# EAGLE design i2c-sensor-bridge (EAGLE 7.4.0)
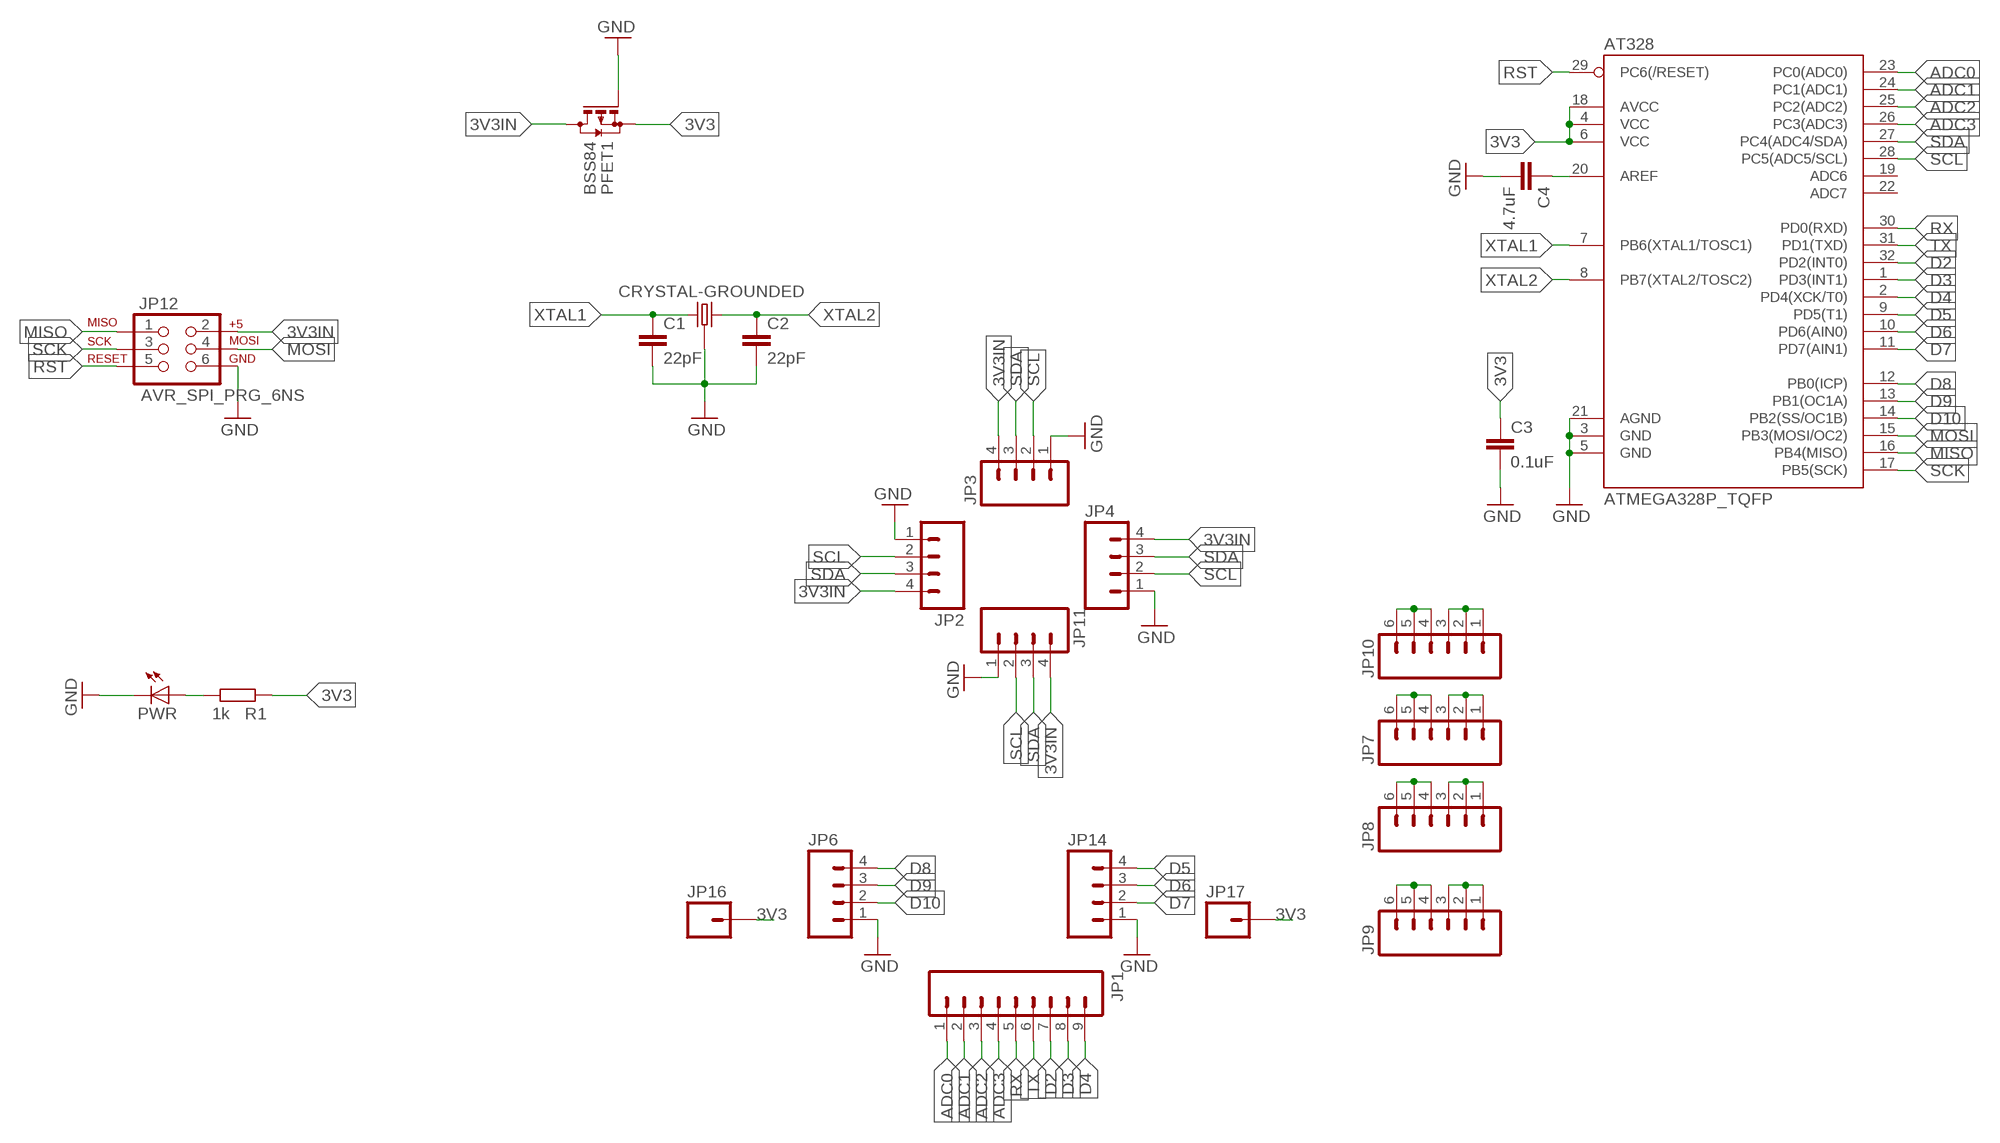
[diagram p0: schematic, sheet 1]

## Parts
AT328  ATMEGA328P_TQFP  [TQFP32-08]
C1  22pF  C-EUC0805  [C0805]
C2  22pF  C-EUC0805  [C0805]
C3  0.1uF  C-EUC0805  [C0805]
C4  4.7uF  C-EUC0805  [C0805]
CRYSTAL  CRYSTAL-GROUNDED  [CRYSTAL-SMD-5X3]
JP1  M09LOCK  [1X09_LOCK]
JP2  M04LOCK  [1X04_LOCK]
JP3  M04LOCK  [1X04_LOCK]
JP4  M04LOCK  [1X04_LOCK]
JP6  M04LOCK  [1X04_LOCK]
JP7  M06NO_SILK_FEMALE_PTH  [1X06_NO_SILK]
JP8  M06NO_SILK_FEMALE_PTH  [1X06_NO_SILK]
JP9  M06NO_SILK_FEMALE_PTH  [1X06_NO_SILK]
JP10  M06NO_SILK_FEMALE_PTH  [1X06_NO_SILK]
JP11  M04LOCK  [1X04_LOCK]
JP12  AVR_SPI_PRG_6NS  [2X3-NS]
JP14  M04LOCK  [1X04_LOCK]
JP16  M01PTH_NO_SILK_YES_STOP  [1X01_NO_SILK]
JP17  M01PTH_NO_SILK_YES_STOP  [1X01_NO_SILK]
PFET1  BSS84  [SOT23]
PWR  LEDCHIPLED_0805  [CHIPLED_0805]
R1  1k  R-EU_R0805  [R0805]

## Nets
3V3 [vreg]: AT328.4(VCC) AT328.6(VCC) AT328.18(AVCC) C3.1 JP16.1 JP17.1 PFET1.2(S) R1.2
3V3IN [vreg]: JP2.4 JP3.4 JP4.4 JP11.4 JP12.2 PFET1.3(D)
ADC0: AT328.23(PC0(ADC0)) JP1.1
ADC1: AT328.24(PC1(ADC1)) JP1.2
ADC2: AT328.25(PC2(ADC2)) JP1.3
ADC3: AT328.26(PC3(ADC3)) JP1.4
D2: AT328.32(PD2(INT0)) JP1.7
D3: AT328.1(PD3(INT1)) JP1.8
D4: AT328.2(PD4(XCK/T0)) JP1.9
D5: AT328.9(PD5(T1)) JP14.4
D6: AT328.10(PD6(AIN0)) JP14.3
D7: AT328.11(PD7(AIN1)) JP14.2
D8: AT328.12(PB0(ICP)) JP6.4
D9: AT328.13(PB1(OC1A)) JP6.3
D10: AT328.14(PB2(SS/OC1B)) JP6.2
GND: AT328.3(GND) AT328.5(GND) AT328.21(AGND) C1.2 C2.2 C3.2 C4.2 CRYSTAL.2 CRYSTAL.4 JP2.1 JP3.1 JP4.1 JP6.1 JP11.1 JP12.6 JP14.1 PFET1.1(G) PWR.C
MISO: AT328.16(PB4(MISO)) JP12.1
MOSI: AT328.15(PB3(MOSI/OC2)) JP12.4
N$1: PWR.A R1.1
N$2 [vreg]: JP10.4 JP10.5 JP10.6
N$3 [vreg]: JP10.1 JP10.2 JP10.3
N$4 [vreg]: JP7.1 JP7.2 JP7.3
N$5 [vreg]: JP7.4 JP7.5 JP7.6
N$6 [vreg]: JP8.4 JP8.5 JP8.6
N$7 [vreg]: JP8.1 JP8.2 JP8.3
N$8 [vreg]: JP9.1 JP9.2 JP9.3
N$9 [vreg]: JP9.4 JP9.5 JP9.6
N$10: AT328.20(AREF) C4.1
RST: AT328.29(PC6(/RESET)) JP12.5
RX: AT328.30(PD0(RXD)) JP1.5
SCK: AT328.17(PB5(SCK)) JP12.3
SCL: AT328.28(PC5(ADC5/SCL)) JP2.2 JP3.2 JP4.2 JP11.2
SDA: AT328.27(PC4(ADC4/SDA)) JP2.3 JP3.3 JP4.3 JP11.3
TX: AT328.31(PD1(TXD)) JP1.6
XTAL1: AT328.7(PB6(XTAL1/TOSC1)) C1.1 CRYSTAL.3
XTAL2: AT328.8(PB7(XTAL2/TOSC2)) C2.1 CRYSTAL.1
Unconnected: AT328.19(ADC6) AT328.22(ADC7)

## Library data of the parts
AT328 = SparkFun-DigitalIC:ATMEGA328P_TQFP; PROD_ID: IC-09069
C1-C4 = rcl:C-EU: CAPACITOR, European symbol
CRYSTAL = SparkFun-FreqCtrlED:CRYSTAL-GROUNDED
JP1 = SparkFun-Connectors:M09: Header 9 Standard 9-pin 0.1" header. Use with straight break away headers (SKU : PRT-00116), right angle break away headers (PRT-00553), swiss pins (PRT-00743), machine pins (PRT-00117), and female headers (PRT-00115).
JP2-JP4 JP6 JP11 JP14 = SparkFun-Connectors:M04: Header 4 Standard 4-pin 0.1" header. Use with straight break away headers (SKU : PRT-00116), right angle break away headers (PRT-00553), swiss pins (PRT-00743), machine pins (PRT-00117), and female headers (PRT-00115). Molex polarized connector foot print use with SKU : PRT-08231 with associated crimp pins and housings. 1MM SMD Version SKU: PRT-10208
JP7-JP10 = SparkFun-Connectors:M06: Header 6 Standard 6-pin 0.1" header. Use with straight break away headers (SKU : PRT-00116), right angle break away headers (PRT-00553), swiss pins (PRT-00743), machine pins (PRT-00117), and female headers (PRT-00115). Molex polarized connector foot print use with SKU : PRT-08094 with associated crimp pins and housings. NOTES ON THE VARIANTS LOCK and LOCK_LONGPADS... This footprint was designed to help hold the alignment of a through-hole component (i.e. 6-pin header) while soldering it into place. You may notice that each hole has been shifted either up or down by 0.005 of an inch from it's more standard position (which is a perfectly straight line). This slight alteration caused the pins (the squares in the middle) to touch the edges of the holes. Because they are alternating, it causes a "brace" to hold the component in place. 0.005 has proven to be the perfect amount of "off-center" position when using our standard breakaway headers. Although looks a little odd when you look at the bare footprint, once you have a header in there, the alteration is very hard to notice. Also,if you push a header all the way into place, it is covered up entirely on the bottom side. This idea of altering the position of holes to aid alignment will be further integrated into the Sparkfun Library for other footprints. It can help hold any component with 3 or more connection pins.; PROD_ID: CONN-08437
JP12 = SparkFun-Connectors:AVR_SPI_PRG_6: AVR ISP 6 Pin This is the reduced ISP connector for AVR programming. Common on Arduino. This footprint will take up less PCB space and can be used with a 10-pin to 6-pin adapter such as SKU: BOB-08508 **Special note about "TEST_POINT" package. The stop mask is on the top side, so if you want your programming test points to be on the bottom of your board, make sure to place this package on the bottom side of the board. This also ensure that the orientation to program from the bottom side will be correct.
JP16 JP17 = SparkFun-Connectors:M01: Header 1 Standard 1-pin 0.1" header. Use with straight break away headers (SKU : PRT-00116), right angle break away headers (PRT-00553), swiss pins (PRT-00743), machine pins (PRT-00117), and female headers (PRT-00115). SMTSO-256-ET is a "flush mount" nut for a 4-40 screw. The older package used to be too tight, and did not allow it to sit properly thru the drill hit. The latest (0.165DIA) fits nice and snug.
PFET1 = transistor-small-signal:BSS84: P-CHANNEL MOS FET
PWR = adafruit:LED: LED OSRAM: - CHIPLED LG R971, LG N971, LY N971, LG Q971, LY Q971, LO R971, LY R971 LH N974, LH R974 LS Q976, LO Q976, LY Q976 LO Q996 - Hyper CHIPLED LW Q18S LB Q993, LB Q99A, LB R99A - SideLED LS A670, LO A670, LY A670, LG A670, LP A670 LB A673, LV A673, LT A673, LW A673 LH A674 LY A675 LS A676, LA A676, LO A676, LY A676, LW A676 LS A679, LY A679, LG A679 - Hyper Micro SIDELED® LS Y876, LA Y876, LO Y876, LY Y876 LT Y87S - SmartLED LW L88C, LW L88S LB L89C, LB L89S, LG L890 LS L89K, LO L89K, LY L89K LS L896, LA L896, LO L896, LY L896 - TOPLED LS T670, LO T670, LY T670, LG T670, LP T670 LSG T670, LSP T670, LSY T670, LOP T670, LYG T670 LG T671, LOG T671, LSG T671 LB T673, LV T673, LT T673, LW T673 LH T674 LS T676, LA T676, LO T676, LY T676, LB T676, LH T676, LSB T676, LW T676 LB T67C, LV T67C, LT T67C, LS T67K, LO T67K, LY T67K, LW E67C LS E67B, LA E67B, LO E67B, LY E67B, LB E67C, LV E67C, LT E67C LW T67C LS T679, LY T679, LG T679 LS T770, LO T770, LY T770, LG T770, LP T770 LB T773, LV T773, LT T773, LW T773 LH T774 LS E675, LA E675, LY E675, LS T675 LS T776, LA T776, LO T776, LY T776, LB T776 LHGB T686 LT T68C, LB T68C - Hyper Mini TOPLED® LB M676 - Mini TOPLED Santana® LG M470 LS M47K, LO M47K, LY M47K Source: http://www.osram.convergy.de/
R1 = resistor:R-EU_: RESISTOR, European symbol

## Net classes
1 vcc: width 0.406 mm
2 vreg: width 0.406 mm

## Board
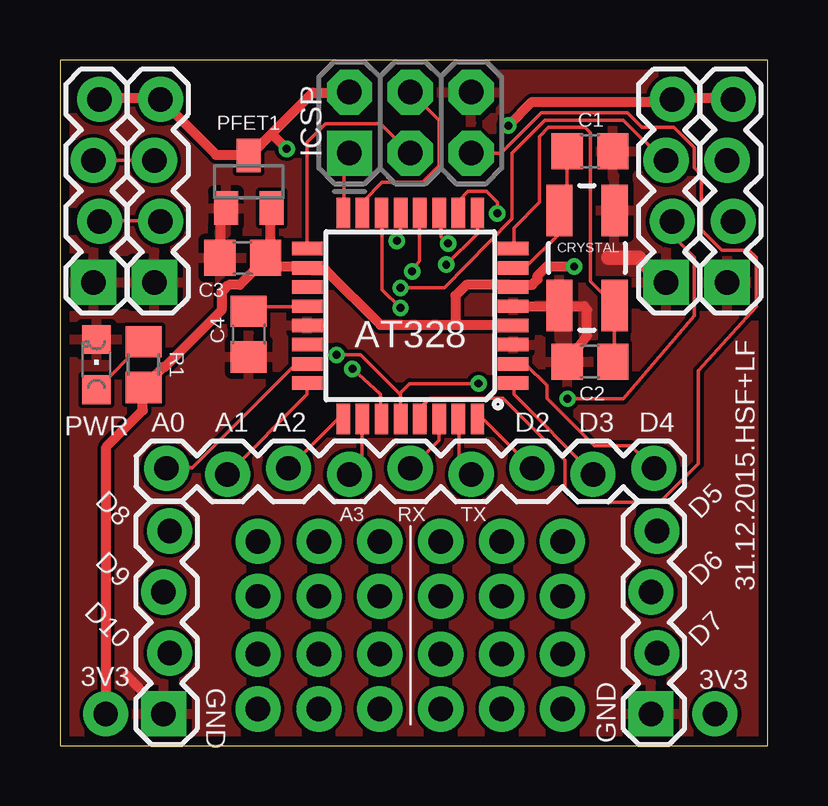
[diagram p1: board, top side]
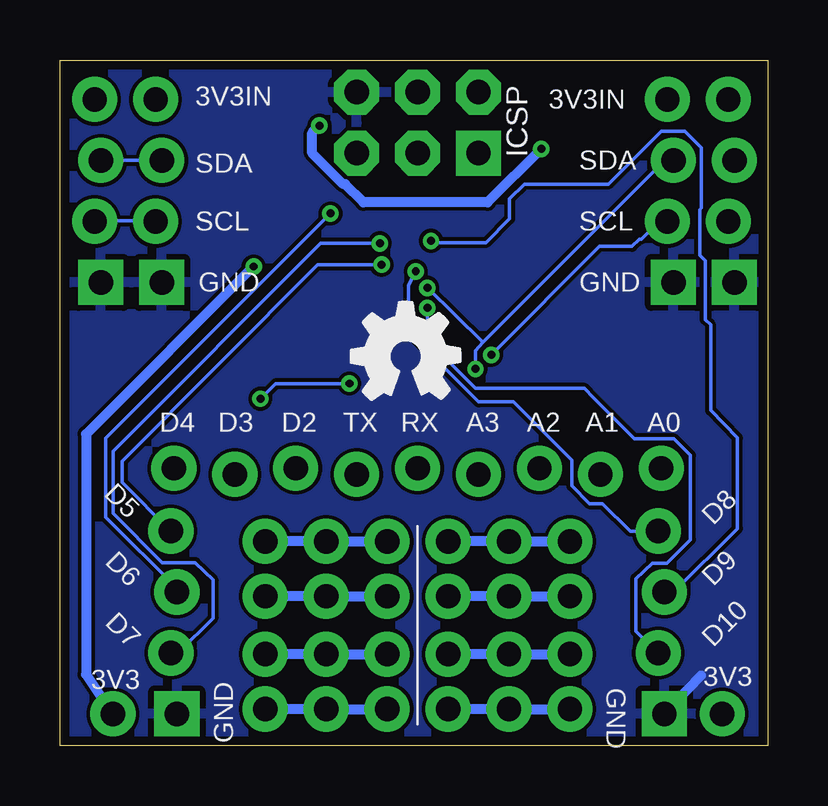
[diagram p2: board, bottom side, seen from below]

Size 29.52 x 28.57 mm. Coordinates in mm from the lower left corner, seen from the top.
Outline: 0,0 29.52,0 29.52,28.57 0,28.56 0,0
Copper layers (1*16): Top 0.0356mm / dielectric 1.5011mm / Bottom 0.0356mm
Design rules "LaenPCBOrder": minimum track width 6mil, minimum drill 13mil, track to track 6mil, track to pad 6mil, pad to pad 6mil, via to via 6mil, smd to smd 6mil, copper to edge 15mil, drill to drill 6mil, minimum pad ring 7mil, minimum via ring 7mil, stop-mask expansion 3mil, vias tented up to drill 0mil, thermal gap 10mil

### Footprints (pad centres in the part's own frame; a part is rotated, then mirrored left to right if it is on the bottom)
TQFP32-08 = smd 1.27 x 0.559: 1 -4.293,2.8; 2 -4.293,2; 3 -4.293,1.2; 4 -4.293,0.4; 5 -4.293,-0.4; 6 -4.293,-1.2; 7 -4.293,-2; 8 -4.293,-2.8; 17 4.293,-2.8; 18 4.293,-2; 19 4.293,-1.2; 20 4.293,-0.4; 21 4.293,0.4; 22 4.293,1.2; 23 4.293,2; 24 4.293,2.8 | smd 0.559 x 1.27: 9 -2.8,-4.293; 10 -2,-4.293; 11 -1.2,-4.293; 12 -0.4,-4.293; 13 0.4,-4.293; 14 1.2,-4.293; 15 2,-4.293; 16 2.8,-4.293; 25 2.8,4.293; 26 2,4.293; 27 1.2,4.293; 28 0.4,4.293; 29 -0.4,4.293; 30 -1.2,4.293; 31 -2,4.293; 32 -2.8,4.293
C0805 = smd 1.3 x 1.5: 1 -0.95,0; 2 0.95,0
CRYSTAL-SMD-5X3 = smd 2.154 x 1.1: 1 -1.977,-1.15; 2 1.977,-1.15; 3 1.977,1.15; 4 -1.977,1.15
1X09_LOCK = drill 1.016 pad 1.88: 1 0,0.127; 2 2.54,-0.127; 3 5.08,0.127; 4 7.62,-0.127; 5 10.16,0.127; 6 12.7,-0.127; 7 15.24,0.127; 8 17.78,-0.127; 9 20.32,0.127
1X04_LOCK = drill 1.016 pad 1.88 square: 1 0,0.127 | drill 1.016 pad 1.88: 2 2.54,-0.127; 3 5.08,0.127; 4 7.62,-0.127
1X06_NO_SILK = drill 1.016 pad 1.88: 1 0,0; 2 2.54,0; 3 5.08,0; 4 7.62,0; 5 10.16,0; 6 12.7,0
2X3-NS = drill 1.016 pad 1.88 square: 1 -2.54,-1.27 | drill 1.016 pad 1.88 octagon: 2 -2.54,1.27; 3 0,-1.27; 4 0,1.27; 5 2.54,-1.27; 6 2.54,1.27
1X01_NO_SILK = drill 1.016 pad 1.88: 1 0,0
SOT23 = smd 1 x 1.4: 1 -0.95,-1.1; 2 0.95,-1.1; 3 0,1.1
CHIPLED_0805 = smd 1.2 x 1.2: A 0,-1.05; C 0,1.05
R0805 = smd 1.3 x 1.5: 1 -0.95,0; 2 0.95,0

### Placement (x,y rotation side)
AT328  14.61,17.91 180 top
C1  22.1,24.77 0 top
C2  22.1,16 180 top
C3  7.62,20.32 180 top
C4  7.87,17.14 270 top
CRYSTAL  21.97,20.32 90 top
JP1  4.45,11.43 0 top
JP2  4.06,19.3 90 top
JP3  1.52,19.3 90 top
JP4  27.94,19.3 90 top
JP6  4.45,1.32 90 top
JP7  8.25,8.51 0 top
JP8  8.25,6.22 0 top
JP9  8.25,3.81 0 top
JP10  8.25,1.52 0 top
JP11  25.4,19.3 90 top
JP12  14.61,25.96 0 top
JP14  24.77,1.32 90 top
JP16  1.9,1.32 0 top
JP17  27.3,1.32 0 top
PFET1  7.87,23.5 0 top
PWR  1.52,15.88 0 top
R1  3.48,15.88 270 top

### Tracks (layer width: path | path; a pad name or v marks a point on that pad's centre or on a via)
3V3  (via drill 0.33)
  Top 0.406: 18.85,17.53 AT328.4 18.69,17.53 16.48,17.53 | 18.85,19.05 AT328.6 | C3.1 8.64,20.27 8.94,19.96 10.31,19.96 AT328.18 10.46,19.81 11.07,19.81 13.36,17.53 16.48,17.53 | PFET1.2 8.79,22.33 8.79,20.65 8.64,20.5 C3.1 | v21.44,19.96 20.29,19.96 19.91,19.58 19.91,19.43 19.68,19.2 19.07,19.2 AT328.6 | 16.48,17.53 16.48,18.75 16.94,19.2 18.77,19.2 AT328.6 | JP16.1 1.93,1.29 1.93,12.45 3.45,13.97 3.45,14.86 R1.2 3.61,15.09 4.29,15.77 4.37,15.77 6.73,18.14 6.73,18.9 7.04,19.2 7.49,19.2 8.48,20.19 C3.1
  Bottom 0.406: v21.44,19.96 28.42,12.98 28.42,2.97 27.3,1.29 JP17.1
3V3IN  (via drill 0.33)
  Top 0.406: JP3.4 1.7,26.97 4.14,26.97 JP2.4 6.5,24.61 7.87,24.61 PFET1.3 8.03,24.69 8.83,25.49 | 25.78,26.9 JP11.4 | JP11.4 25.78,26.97 28.3,26.97 JP4.4 | 8.83,25.49 10.54,27.2 12.06,27.2 JP12.2 | v18.69,25.83 19.68,26.82 25.63,26.82 JP11.4 | 8.83,25.49 v9.45,24.87
  Bottom 0.406: v18.69,25.83 19,25.53 19,24.69 17.7,23.39 17.63,23.39 16.87,22.63 11.68,22.63 v9.45,24.87
ADC0
  Top 0.152: AT328.23 10.31,15.85 9.78,15.85 5.51,11.58 4.45,11.58 JP1.1
ADC1
  Top 0.152: AT328.24 10.31,14.63 JP1.2
ADC2
  Top 0.152: JP1.3 11.53,13.56 11.76,13.56 AT328.25
ADC3
  Top 0.152: AT328.26 12.6,13.56 12.6,11.89 12.06,11.35 JP1.4
D2
  Top 0.152: AT328.32 17.47,13.56 17.7,13.56 19.68,11.58 JP1.7
D3
  Top 0.152: AT328.1 18.92,15.09 18.92,14.63 22.2,11.35 JP1.8
D4
  Top 0.152: AT328.2 18.92,15.85 19.46,15.85 20.29,15.01 20.29,14.48 22.28,12.5 23.8,12.5 24.71,11.58 JP1.9
D5  (via drill 0.33)
  Top 0.152: v16.1,20.04 17.4,21.34 17.4,22.17 AT328.9
  Bottom 0.152: v16.1,20.04 18.77,20.04 26.92,11.85 26.92,10.97 JP14.4
D6  (via drill 0.33)
  Top 0.152: v18.24,22.17 18.24,22.63 17.78,23.09 17.02,23.09 16.64,22.71 16.64,22.25 AT328.10
  Bottom 0.152: v18.24,22.17 27.61,12.8 27.61,9.52 24.64,6.55 JP14.3
D7  (via drill 0.33)
  Top 0.152: v16.18,20.93 15.88,21.21 15.88,22.17 AT328.11
  Bottom 0.152: v16.18,20.93 18.64,20.93 27.3,12.27 27.3,9.68 25.25,7.62 23.88,7.62 23.14,6.91 23.14,5.31 24.56,3.89 24.87,3.89 JP14.2
D8  (via drill 0.33)
  Top 0.152: v14.68,19.76 14.99,20.19 14.99,22.17 AT328.12
  Bottom 0.152: v14.68,19.76 14.99,19.18 14.99,17.22 12.06,14.33 10.62,14.33 8.18,11.89 8.18,10.82 7.44,10.08 6.91,10.08 5.74,8.94 JP6.4
D9  (via drill 0.33)
  Top 0.152: v14.05,21.03 14.2,21.18 14.2,22.17 AT328.13
  Bottom 0.152: v14.05,21.03 13.97,20.95 11.76,20.95 10.77,21.95 10.77,22.78 10.16,23.39 6.65,23.39 4.45,25.6 3.45,25.6 2.77,24.92 2.77,22.4 2.84,22.33 2.84,20.42 2.62,20.19 2.62,17.75 2.39,17.53 2.39,13.97 1.27,12.83 1.27,9.04 3.91,6.4 JP6.3
D10  (via drill 0.33)
  Top 0.152: v14.2,18.24 13.44,19 13.44,22.17 AT328.14
  Bottom 0.152: v14.2,18.24 14.2,16.89 12.19,14.88 7.64,14.88 7.26,14.48 5.56,12.78 3.91,12.78 3.23,12.09 3.23,8.59 4.22,7.59 4.83,7.59 5.51,6.96 5.51,4.77 4.6,3.86 JP6.2
GND
  Top 0.152: PFET1.1 6.96,22.4 6.88,22.4 | 21.86,18.31 21.59,18.41
  Top 0.406: PFET1.1 6.67,22.39 C3.2 | JP6.1 2.79,2.92 | AT328.5 21.86,18.31 21.97,18.16 21.97,17.08 C2.2
  Top 0.61: JP11.1 24.77,19.69 24.13,20.32 22.86,20.32
  Bottom 0.406: JP6.1 2.79,2.92
  pour Bottom: -8.89,34.92 38.1,34.92 38.1,-10.8 -8.89,-10.8
  pour Top: -8.89,-10.8 38.1,-10.8 38.1,34.92 -8.89,34.92
MISO
  Top 0.152: 11.84,22.25 AT328.16 11.84,22.33 11.84,24.46 JP12.1
MOSI
  Top 0.152: AT328.15 12.68,22.25 12.68,22.71 13.44,23.47 15.11,23.47 15.8,24.16 15.8,26.06 14.66,27.2 JP12.4
N$1
  Top 0.152: PWR.A 1.55,14.86 3.45,16.76 R1.1
N$2
  Bottom 0.406: JP10.4 JP10.5 JP10.6
N$3
  Bottom 0.406: JP10.1 JP10.2 JP10.3
N$4
  Bottom 0.406: JP7.1 JP7.2 JP7.3
N$5
  Bottom 0.406: JP7.4 JP7.5 JP7.6
N$6
  Bottom 0.406: JP8.4 JP8.5 JP8.6
N$7
  Bottom 0.406: JP8.1 JP8.2 JP8.3
N$8
  Bottom 0.406: JP9.1 JP9.2 JP9.3
N$9
  Bottom 0.406: JP9.4 JP9.5 JP9.6
N$10
  Top 0.152: AT328.20 10.31,18.29 8.03,18.29 7.87,18.14 C4.1
RST
  Top 0.152: AT328.29 15.04,13.64 15.04,14.1 15.42,14.48 18.47,14.48 21.06,11.89 21.06,10.74 21.67,10.13 25.02,10.13 26.62,11.73 26.62,15.62 29.03,18.29 29.03,20.34 28.73,20.65 27.58,20.65 26.75,21.49 26.75,23.77 26.44,24.08 26.44,24.92 25.6,25.76 24.26,25.76 23.65,26.36 20.07,26.36 18.39,24.69 JP12.5
RX
  Top 0.152: AT328.30 15.8,13.56 15.8,12.72 14.66,11.58 JP1.5
SCK
  Top 0.152: AT328.17 10.31,25.15 11.07,25.91 13.36,25.91 14.58,24.69 JP12.3
SCL  (via drill 0.33)
  Top 0.152: 14.16,14.67 12.52,16.28 v11.53,16.28 | 14.16,14.67 14.2,14.63 14.2,13.64 AT328.28 | JP3.2 1.7,21.87 4.14,21.87 JP2.2 | v21.16,14.45 23.49,14.45 26.44,17.91 26.44,20.34 25.53,21.26 JP11.2 | v17.45,15.09 14.58,15.09 14.16,14.67
  Bottom 0.152: JP11.2 25.78,21.87 28.3,21.87 JP4.2 | v11.53,16.28 7.04,20.8 5.66,20.8 5.36,21.11 5.28,21.11 4.6,21.79 4.22,21.79 JP2.2 | v21.16,14.45 20.52,15.09 v17.45,15.09
SDA  (via drill 0.33)
  Top 0.152: v12.19,15.7 13.36,14.63 13.36,13.64 AT328.27 | JP2.3 JP3.3 | JP11.3 25.17,24.38 23.49,26.06 20.22,26.06 18.85,24.69 18.85,21.95 16.03,19.08 v14.2,19.08
  Bottom 0.152: JP4.3 JP11.3 | v12.19,15.7 12.19,16.46 11.88,16.8 | 11.88,16.8 4.29,24.38 JP2.3 | 11.88,16.8 v14.2,19.08
TX
  Top 0.152: JP1.6 16.64,11.81 16.64,13.56 AT328.31
XTAL1
  Top 0.152: AT328.7 18.92,19.96 19.46,19.96 20.75,21.26 20.75,22.25 CRYSTAL.3 20.83,22.33 21.13,22.63 21.13,24.77 C1.1
XTAL2
  Top 0.152: AT328.8 18.92,20.73 18.92,21.56 19.99,22.63 19.99,25.38 20.37,25.76 21.89,25.76 22.12,25.53 22.12,19.36 23.11,18.36 CRYSTAL.1 23.11,18.29 23.11,16 C2.1

### Text on the board
tNames: ICSP | A0 | A1 | A2 | D2 | D3 | D4 | 31.12.2015.HSF+LF | D8 | A3 | RX | TX | D5 | D9 | D6 | D10 | 3V3 | D7 | 3V3 | GND | GND
bNames: 3V3IN | 3V3IN | ICSP | SDA | SDA | SCL | SCL | GND | GND | A0 | A1 | A2 | A3 | RX | TX | D2 | D3 | D4 | D8 | D5 | D6 | D9 | D7 | 3V3 | D10 | 3V3 | GND | GND